# Altium schematic sheet 12 - Audio Interfaces.SchDoc
size B; CompanyName: Microchip Technology Inc.; Organization: Microchip Technology; Address1: 2355 West Chandler Blvd.; Address2: Chandler, AZ  85224; Address4: USA; SheetNumber: 13; SheetTotal: 15; SheetTitle: Audio Interfaces; Time: Time
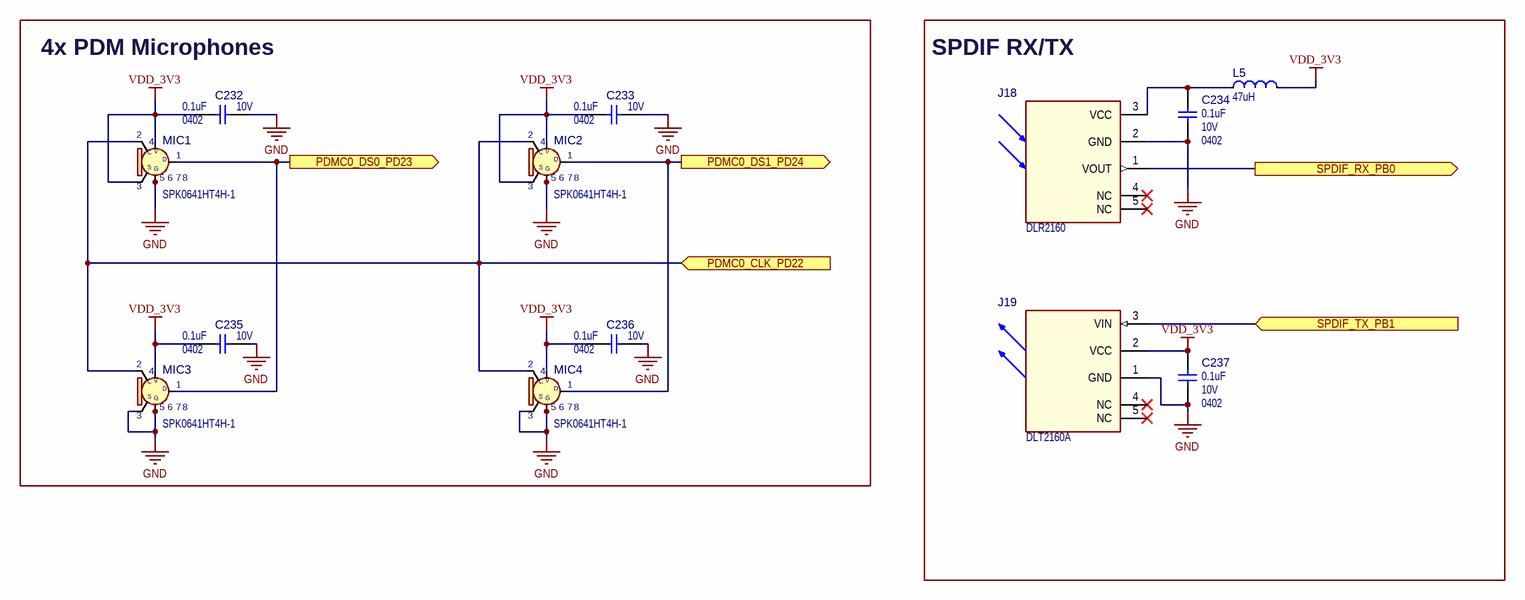
[diagram p0: 12 - Audio Interfaces.SchDoc]

## Parts
?  (no value)  (graphical)
C232  value 0.1uF  Voltage: 10V  Package: 0402  [CAP_C_0402]  (hidden comment: Capacitor NP)
C233  value 0.1uF  Voltage: 10V  Package: 0402  [CAP_C_0402]  (hidden comment: Capacitor NP)
C234  value 0.1uF  Voltage: 10V  Package: 0402  [CAP_C_0402]  (hidden comment: Capacitor NP)
C235  value 0.1uF  Voltage: 10V  Package: 0402  [CAP_C_0402]  (hidden comment: Capacitor NP)
C236  value 0.1uF  Voltage: 10V  Package: 0402  [CAP_C_0402]  (hidden comment: Capacitor NP)
C237  value 0.1uF  Voltage: 10V  Package: 0402  [CAP_C_0402]  (hidden comment: Capacitor NP)
J18  value DLR2160  [CON_PHOTOLINK_TH_RA_FCR684208]  (hidden comment: FCR684208R)
J19  value DLT2160A  [CON_PHOTOLINK_TH_RA_FCR684208]  (hidden comment: FCR684208T)
L5  value 47uH  [IND_C_0805]  (hidden comment: Inductor)
MIC1  value SPK0641HT4H-1  [CON_MICROPHONE_SPK0641HT4H-1]  (hidden comment: MIC_SMD_SPK0641HT4H-1)
MIC2  value SPK0641HT4H-1  [CON_MICROPHONE_SPK0641HT4H-1]  (hidden comment: MIC_SMD_SPK0641HT4H-1)
MIC3  value SPK0641HT4H-1  [CON_MICROPHONE_SPK0641HT4H-1]  (hidden comment: MIC_SMD_SPK0641HT4H-1)
MIC4  value SPK0641HT4H-1  [CON_MICROPHONE_SPK0641HT4H-1]  (hidden comment: MIC_SMD_SPK0641HT4H-1)

## Blocks framed on the sheet
4x PDM Microphones: C232 C233 C235 C236 MIC1-MIC4
SPDIF RX/TX: C234 C237 J18 J19 L5

## Ports
PDMC0_CLK_PD22 (in), PDMC0_DS0_PD23 (out), PDMC0_DS1_PD24 (out), SPDIF_RX_PB0 (out), SPDIF_TX_PB1 (in)

## Nets
GND: C232.2 C233.2 C234.1 C235.2 C236.2 C237.1 J18.2(GND) J19.1(GND) MIC1.5(GND) MIC1.6(GND) MIC1.7(GND) MIC1.8(GND) MIC2.5(GND) MIC2.6(GND) MIC2.7(GND) MIC2.8(GND) MIC3.3(SELECT) MIC3.5(GND) MIC3.6(GND) MIC3.7(GND) MIC3.8(GND) MIC4.3(SELECT) MIC4.5(GND) MIC4.6(GND) MIC4.7(GND) MIC4.8(GND)
VDD_3V3: C232.1 C233.1 C235.1 C236.1 C237.2 J19.2(VCC) L5.2(F) MIC1.3(SELECT) MIC1.4(VDD) MIC2.3(SELECT) MIC2.4(VDD) MIC3.4(VDD) MIC4.4(VDD)
PDMC0_CLK_PD22: MIC1.2(CLOCK) MIC2.2(CLOCK) MIC3.2(CLOCK) MIC4.2(CLOCK) ; port PDMC0_CLK_PD22
PDMC0_DS0_PD23: MIC1.1(DATA) MIC3.1(DATA) ; port PDMC0_DS0_PD23
PDMC0_DS1_PD24: MIC2.1(DATA) MIC4.1(DATA) ; port PDMC0_DS1_PD24
SPDIF_RX_PB0: J18.1(VOUT) ; port SPDIF_RX_PB0
SPDIF_TX_PB1: J19.3(VIN) ; port SPDIF_TX_PB1
NetC234_2: C234.2 J18.3(VCC) L5.1(S)

Not connected (* = marked no-connect by the designer): J18 4(NC)* 5(NC)*; J19 4(NC)* 5(NC)*

## Notes on the sheet
- Drawn By:
- Engineer:
- PartNumber:
- Project Title
- Sheet Title
- Size
- B
- SCH #:
- PCB #:
- Rev:
- Variant Name
- Date:
- Sheet
- Designed with
- Altium.com <http://go.altium.com/MicrochipLandingPage_Evaluation.html>
- File:
- (in symbol SNSR1083) C; V; D; S; G

## Library data of the parts
? = Title Block B
C232-C237 = CAP1238: Capacitor; Manufacturer 1: KEMET; Manufacturer Part Number 1: C0402C104K8RACTU; Description_: CAP CER 0.1uF 10V 10% X7R SMD 0402; Dev Tools Status: Production; Tolerance: 10%; Temperature Coeffcient: X7R; Type: Ceramic; Owner: Tad Ahlvers; Populated: YES; MCHP-ID: CAP1238; Revision: 1; Symbol: Capacitor NP; Status: MCL Design; ComponentLink1URL: https://chn-vm-apps.microchip.com/mchprepo/parts/Datasheets/KEM_C1002_X7R_SMD.pdf; ComponentLink1Description: SVN Datasheet; ComponentLink2URL: C:\ALTIUM_WORK\00001_MCHP-CDB\Datasheets\KEM_C1002_X7R_SMD.pdf; ComponentLink2Description: Local Datasheet; ComponentLink3URL: C:\ALTIUM_WORK\00001_MCHP-CDB\Library\LibraryRefs\Capacitor NP.SchLib; ComponentLink3Description: Open Symbol; ComponentLink4URL: C:\ALTIUM_WORK\00001_MCHP-CDB\Library\Footprints\CAP_C_0402.PcbLib; ComponentLink4Description: Open Footprint; ComponentLink5Description: Open Footprint 2; ComponentLink6Description: Open Footprint 3; ComponentLink7Description: Open Footprint 4; Operating Temperature: -55C to +125C; Category: Capacitor; Supplier 1: Digi-Key; Supplier Part Number 1: 399-3520-2-ND; Quantity Override: 1; Manufacturer 2: Samsung; Manufacturer Part Number 2: CL05B104KP5NNNC; Manufacturer 3: Murata Electronics; Manufacturer Part Number 3: GRM155R71A104KA01D; Supplier 2: Digi-Key; Supplier Part Number 2: 1276-1002-2-ND; Supplier 3: Mouser; Supplier Part Number 3: 81-GRM155R71A104KA1D
J18 = IC2032: Manufacturer 1: Aixin Opto-Electrical Technology Co., Ltd; MCHP-ID: IC2032; Description_: IC SPECIAL DLR2160 PHOTOLINK RECEIVER DLR2160; Dev Tools Status: Design; Owner: Ciprian Abramov; Populated: YES; Revision: 1; Symbol: FCR684208R; Status: MCL Design; Package: FCR684208; ComponentLink1URL: https://chn-vm-apps.microchip.com/mchprepo/parts/Datasheets/DLR2160.pdf; ComponentLink1Description: SVN Datasheet; ComponentLink2URL: C:\ALTIUM_WORK\00001_MCHP-CDB\Datasheets\DLR2160.pdf; ComponentLink2Description: Local Datasheet; ComponentLink3URL: C:\ALTIUM_WORK\00001_MCHP-CDB\Library\LibraryRefs\FCR684208R.SchLib; ComponentLink3Description: Open Symbol; ComponentLink4URL: C:\ALTIUM_WORK\00001_MCHP-CDB\Library\Footprints\CON_PHOTOLINK_TH_RA_FCR684208.PcbLib; ComponentLink4Description: Open Footprint; ComponentLink5Description: Open Footprint 2; ComponentLink6Description: Open Footprint 3; ComponentLink7Description: Open Footprint 4; Operating Temperature: -20C to 70C; Type: Specialized; Category: IC; Manufacturer Part Number 1: DLR2160; Supplier 1: Aixin Opto-Electrical Technology Co., Ltd; Supplier Part Number 1: DLR2160; Quantity Override: 1
J19 = IC2031: Manufacturer 1: Aixin Opto-Electrical Technology Co., Ltd; MCHP-ID: IC2031; Description_: IC SPECIAL DLT2160A PHOTOLINK TRANSMITTER DLT2160A; Dev Tools Status: Design; Vin: 2.7V to 5.5V; Owner: Ciprian Abramov; Populated: YES; Revision: 1; Symbol: FCR684208T; Status: MCL Design; Package: FCR684208; ComponentLink1URL: https://chn-vm-apps.microchip.com/mchprepo/parts/Datasheets/DLT2160A.pdf; ComponentLink1Description: SVN Datasheet; ComponentLink2URL: C:\ALTIUM_WORK\00001_MCHP-CDB\Datasheets\DLT2160A.pdf; ComponentLink2Description: Local Datasheet; ComponentLink3URL: C:\ALTIUM_WORK\00001_MCHP-CDB\Library\LibraryRefs\FCR684208T.SchLib; ComponentLink3Description: Open Symbol; ComponentLink4URL: C:\ALTIUM_WORK\00001_MCHP-CDB\Library\Footprints\CON_PHOTOLINK_TH_RA_FCR684208.PcbLib; ComponentLink4Description: Open Footprint; ComponentLink5Description: Open Footprint 2; ComponentLink6Description: Open Footprint 3; ComponentLink7Description: Open Footprint 4; Operating Temperature: -20C to +70C; Type: Specialized; Category: IC; Manufacturer Part Number 1: DLT2160A; Supplier 1: Aixin Opto-Electrical Technology Co., Ltd; Supplier Part Number 1: DLT2160A; Quantity Override: 1
L5 = IND1747: Manufacturer 1: TDK Corporation; Manufacturer Part Number 1: MLZ2012M470WT000; Description_: INDUCTOR 47uH 170mA 20% SMD 0805; Dev Tools Status: Design; Owner: Ciprian Abramov; DCR: 3.7R; Saturation Current: 50mA; RMS Current: 170mA; Test Frequency: 2MHz; Populated: YES; MCHP-ID: IND1747; Revision: 1; Symbol: Inductor; Status: MCL Design; ComponentLink1URL: https://chn-vm-apps.microchip.com/mchprepo/parts/Datasheets/inductor_commercial_decoupling_mlz2012_en.pdf; ComponentLink1Description: SVN Datasheet; ComponentLink2URL: C:\ALTIUM_WORK\00001_MCHP-CDB\Datasheets\inductor_commercial_decoupling_mlz2012_en.pdf; ComponentLink2Description: Local Datasheet; ComponentLink3URL: C:\ALTIUM_WORK\00001_MCHP-CDB\Library\LibraryRefs\Inductor.SchLib; ComponentLink3Description: Open Symbol; ComponentLink4URL: C:\ALTIUM_WORK\00001_MCHP-CDB\Library\Footprints\IND_C_0805.PcbLib; ComponentLink4Description: Open Footprint; ComponentLink5Description: Open Footprint 2; ComponentLink6Description: Open Footprint 3; ComponentLink7Description: Open Footprint 4; Operating Temperature: -55C to +125C; Package: 0805; Type: Inductor; Category: Inductor; Supplier 1: Digi-Key; Supplier Part Number 1: 445-6400-1-ND; Quantity Override: 1
MIC1-MIC4 = SNSR1083: Manufacturer 1: Knowles; Description_: SENSOR ACOUSTIC MICROPHONE MEMS OMNIDIRECTIONAL 20Hz to 20kHz SMD 4x3x1.1; Dev Tools Status: Production; Owner: Ciprian Abramov; Voltage: 3.3V; Current: 270uA; Populated: YES; ComponentLink1URL: https://chn-vm-apps.microchip.com/mchprepo/parts/Datasheets/spk0641ht4h-1-rev-a.pdf; MCHP-ID: SNSR1083; Revision: 1; Symbol: MIC_SMD_SPK0641HT4H-1; Status: MCL Design; ComponentLink1Description: SVN Datasheet; ComponentLink2URL: C:\ALTIUM_WORK\00001_MCHP-CDB\Datasheets\spk0641ht4h-1-rev-a.pdf; ComponentLink2Description: Local Datasheet; ComponentLink3URL: C:\ALTIUM_WORK\00001_MCHP-CDB\Library\LibraryRefs\MIC_SMD_SPK0641HT4H-1.SchLib; ComponentLink3Description: Open Symbol; ComponentLink4URL: C:\ALTIUM_WORK\00001_MCHP-CDB\Library\Footprints\CON_MICROPHONE_SPK0641HT4H-1.PcbLib; ComponentLink4Description: Open Footprint; ComponentLink5Description: Open Footprint 2; ComponentLink6Description: Open Footprint 3; ComponentLink7Description: Open Footprint 4; Operating Temperature: -40C to +100C; Package: SMD_4x3x1.1; Type: Acoustic; Category: Sensor; Manufacturer Part Number 1: SPK0641HT4H-1; Supplier 1: Digi-Key; Supplier Part Number 1: 423-1425-1-ND; Quantity Override: 1